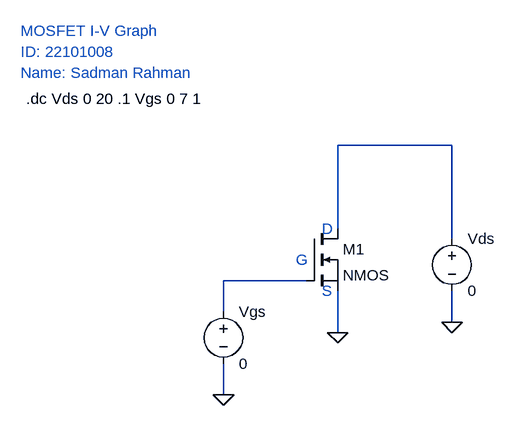
[diagram p0: schematic Task2.asc]
Task2.asc, the LTspice schematic file:
Version 4
SHEET 1 880 680
WIRE 448 16 272 16
WIRE 272 144 272 16
WIRE 448 160 448 16
WIRE 224 224 96 224
WIRE 96 272 96 224
WIRE 448 288 448 240
WIRE 272 304 272 240
WIRE 96 400 96 352
FLAG 96 400 0
FLAG 448 288 0
FLAG 272 304 0
SYMBOL nmos 224 144 R0
SYMATTR InstName M1
SYMBOL voltage 96 256 R0
SYMATTR InstName Vgs
SYMATTR Value 0
SYMBOL voltage 448 144 R0
SYMATTR InstName Vds
SYMATTR Value 0
TEXT 208 192 Left 2 ;G
TEXT 248 240 Left 2 ;S
TEXT 248 144 Left 2 ;D
TEXT -216 -160 Left 2 ;MOSFET I-V Graph
TEXT -216 -128 Left 2 ;ID: 22101008
TEXT -216 -96 Left 2 ;Name: Sadman Rahman
TEXT -208 -56 Left 2 !.dc Vds 0 20 .1 Vgs 0 7 1

The netlist it stands for:
* Task2.asc
M1 N001 N002 0 0 NMOS
Vgs N002 0 0
Vds N001 0 0
.model NMOS NMOS
.model PMOS PMOS
.lib standard.mos
* G
* S
* D
* MOSFET I-V Graph
* ID: 22101008
* Name: Sadman Rahman
.dc Vds 0 20 .1 Vgs 0 7 1
.backanno
.end